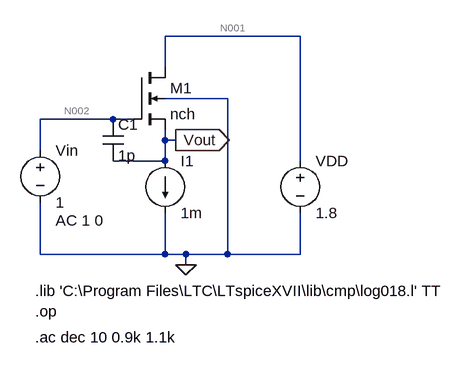
[diagram p0: schematic Ex3.asc]
Ex3.asc, the LTspice schematic file:
Version 4
SHEET 1 880 680
WIRE 448 64 240 64
WIRE 240 112 240 64
WIRE 336 160 240 160
WIRE 160 192 48 192
WIRE 192 192 160 192
WIRE 240 224 240 208
WIRE 256 224 240 224
WIRE 48 240 48 192
WIRE 240 256 240 224
WIRE 240 256 160 256
WIRE 448 256 448 64
WIRE 48 400 48 320
WIRE 240 400 240 336
WIRE 240 400 48 400
WIRE 272 400 240 400
WIRE 336 400 336 160
WIRE 336 400 272 400
WIRE 448 400 448 336
WIRE 448 400 336 400
WIRE 272 416 272 400
FLAG 272 416 0
FLAG 256 224 Vout
IOPIN 256 224 Out
SYMBOL nmos4 192 112 R0
SYMATTR InstName M1
SYMATTR Value nch
SYMATTR Value2 l=0.18u w=10u
SYMBOL current 240 256 R0
WINDOW 123 0 0 Left 0
WINDOW 39 0 0 Left 0
SYMATTR InstName I1
SYMATTR Value 1m
SYMBOL voltage 448 240 R0
WINDOW 123 0 0 Left 0
WINDOW 39 0 0 Left 0
SYMATTR InstName VDD
SYMATTR Value 1.8
SYMBOL voltage 48 224 R0
WINDOW 123 24 124 Left 2
WINDOW 39 0 0 Left 0
SYMATTR Value2 AC 1 0
SYMATTR InstName Vin
SYMATTR Value 1
SYMBOL cap 144 192 R0
SYMATTR InstName C1
SYMATTR Value 1p
TEXT 40 456 Left 2 !.lib 'C:\\Program Files\\LTC\\LTspiceXVII\\lib\\cmp\\log018.l' TT
TEXT 40 488 Left 2 !.op
TEXT 40 528 Left 2 !.ac dec 10 0.9k 1.1k

The netlist it stands for:
* Ex3.asc
M1 N001 N002 Vout 0 nch l=0.18u w=10u
I1 Vout 0 1m
VDD N001 0 1.8
Vin N002 0 1 AC 1 0
C1 N002 Vout 1p
.model NMOS NMOS
.model PMOS PMOS
.lib standard.mos
.lib 'C:\Program Files\LTC\LTspiceXVII\lib\cmp\log018.l' TT
.op
.ac dec 10 0.9k 1.1k
.backanno
.end

* Results of the author's LTspice run, read from the files saved beside the schematic
* Operating Point, zero values left out:
*   V(n001) = 1.8 V
*   V(n002) = 1 V
*   V(vout) = 149.8 mV
*   Id(M1) = 1 mA
*   Ib(M1) = -219.5 nA
*   Is(M1) = -1 mA
*   I(I1) = 1 mA
*   I(Vdd) = -1 mA
* From the log:
*   Semiconductor Device Operating Points:
*                           --- BSIM3 MOSFETS ---
*   Name:        m1
*   Model:      nch.6
*   Id:        1.00e-03
*   Vgs:       8.50e-01
*   Vds:       1.65e+00
*   Vbs:      -1.50e-01
*   Vth:       5.46e-01
*   Vdsat:     2.01e-01
*   Gm:        4.28e-03
*   Gds:       1.10e-04
*   Gmb        1.05e-03
*   Cbd:       0.00e+00
*   Cbs:       0.00e+00
*   Cgsov:     3.66e-15
*   Cgdov:     3.66e-15
*   Cgbov:     3.18e-17
*   dQgdVgb:   1.91e-14
*   dQgdVdb:  -3.63e-15
*   dQgdVsb:  -1.40e-14
*   dQddVgb:  -3.66e-15
*   dQddVdb:   3.66e-15
*   dQddVsb:   2.75e-18
*   dQbdVgb:  -2.38e-15
*   dQbdVdb:   4.43e-18
*   dQbdVsb:  -1.46e-15